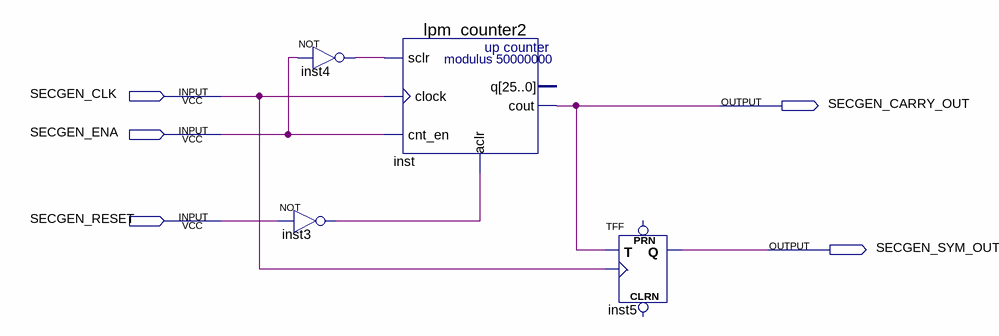
[diagram p0: schematic sheet]
// Quartus schematic SECGEN.bdf as structural Verilog: 4 symbols, 5 pins
module SECGEN (
  input  SECGEN_CLK,
  input  SECGEN_ENA,
  input  SECGEN_RESET,
  output SECGEN_CARRY_OUT,
  output SECGEN_SYM_OUT
);

  wire inst3_out, inst4_out;

  not inst4 (inst4_out, SECGEN_ENA);
  not inst3 (inst3_out, SECGEN_RESET);
  lpm_counter2 inst (
    .sclr(inst4_out), .clock(SECGEN_CLK), .cnt_en(SECGEN_ENA), .aclr(inst3_out), .cout(SECGEN_CARRY_OUT));  // open: q
  TFF inst5 (.T(SECGEN_CARRY_OUT), .CLK(SECGEN_CLK), .Q(SECGEN_SYM_OUT));  // open: PRN, CLRN
endmodule
